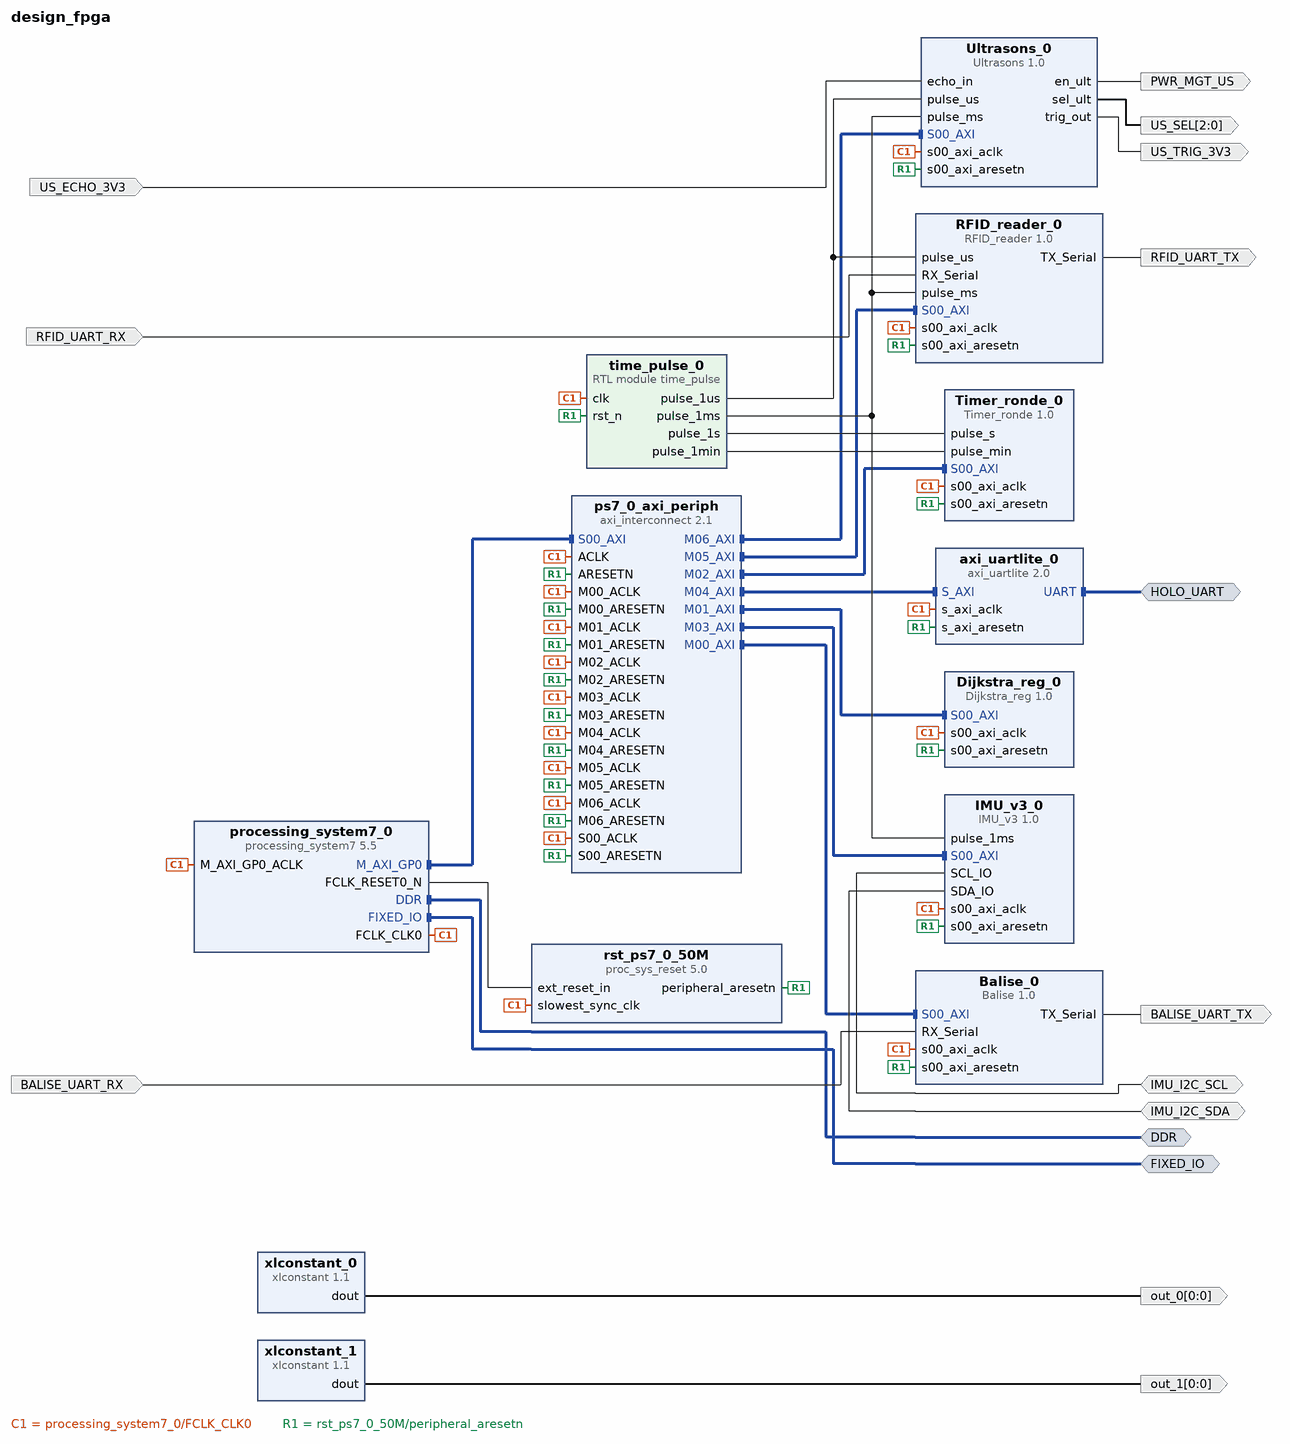
[diagram p0: block diagram of the top level]
# Vivado block design design_fpga, xc7z020clg400-1, Vivado 2020.2
create_bd_design design_fpga

create_bd_intf_port -mode Master -vlnv xilinx.com:interface:ddrx_rtl:1.0 DDR
create_bd_intf_port -mode Master -vlnv xilinx.com:display_processing_system7:fixedio_rtl:1.0 FIXED_IO
create_bd_intf_port -mode Master -vlnv xilinx.com:interface:uart_rtl:1.0 HOLO_UART
create_bd_port -dir I BALISE_UART_RX
create_bd_port -dir O BALISE_UART_TX
create_bd_port -dir IO IMU_I2C_SDA
create_bd_port -dir IO IMU_I2C_SCL
create_bd_port -dir I RFID_UART_RX
create_bd_port -dir O RFID_UART_TX
create_bd_port -dir I US_ECHO_3V3
create_bd_port -dir O PWR_MGT_US
create_bd_port -dir O -from 2 -to 0 US_SEL
create_bd_port -dir O US_TRIG_3V3
create_bd_port -dir O -from 0 -to 0 out_0
create_bd_port -dir O -from 0 -to 0 out_1

create_bd_cell -type module -reference time_pulse time_pulse_0
create_bd_cell -type ip -vlnv xilinx.com:ip:processing_system7:5.5 processing_system7_0
set_property -dict [list \
  CONFIG.PCW_APU_PERIPHERAL_FREQMHZ 667 \
  CONFIG.PCW_ENET0_ENET0_IO {MIO 16 .. 27} \
  CONFIG.PCW_ENET0_GRP_MDIO_ENABLE 1 \
  CONFIG.PCW_ENET0_GRP_MDIO_IO {MIO 52 .. 53} \
  CONFIG.PCW_ENET0_PERIPHERAL_ENABLE 1 \
  CONFIG.PCW_ENET0_RESET_ENABLE 0 \
  CONFIG.PCW_ENET_RESET_ENABLE 1 \
  CONFIG.PCW_ENET_RESET_SELECT {Share reset pin} \
  CONFIG.PCW_FPGA1_PERIPHERAL_FREQMHZ 155 \
  CONFIG.PCW_GPIO_MIO_GPIO_ENABLE 1 \
  CONFIG.PCW_GPIO_MIO_GPIO_IO MIO \
  CONFIG.PCW_I2C_RESET_ENABLE 1 \
  CONFIG.PCW_PRESET_BANK1_VOLTAGE {LVCMOS 1.8V} \
  CONFIG.PCW_QSPI_GRP_FBCLK_ENABLE 1 \
  CONFIG.PCW_QSPI_GRP_FBCLK_IO {MIO 8} \
  CONFIG.PCW_QSPI_GRP_SINGLE_SS_ENABLE 1 \
  CONFIG.PCW_QSPI_GRP_SINGLE_SS_IO {MIO 1 .. 6} \
  CONFIG.PCW_QSPI_PERIPHERAL_ENABLE 1 \
  CONFIG.PCW_QSPI_QSPI_IO {MIO 1 .. 6} \
  CONFIG.PCW_SD0_GRP_CD_ENABLE 1 \
  CONFIG.PCW_SD0_GRP_CD_IO {MIO 47} \
  CONFIG.PCW_SD0_GRP_WP_ENABLE 0 \
  CONFIG.PCW_SD0_PERIPHERAL_ENABLE 1 \
  CONFIG.PCW_SD0_SD0_IO {MIO 40 .. 45} \
  CONFIG.PCW_SDIO_PERIPHERAL_FREQMHZ 50 \
  CONFIG.PCW_SINGLE_QSPI_DATA_MODE x4 \
  CONFIG.PCW_UART1_PERIPHERAL_ENABLE 1 \
  CONFIG.PCW_UART1_UART1_IO {MIO 48 .. 49} \
  CONFIG.PCW_UART_PERIPHERAL_FREQMHZ 100 \
  CONFIG.PCW_UIPARAM_DDR_FREQ_MHZ 533.333333 \
  CONFIG.PCW_UIPARAM_DDR_MEMORY_TYPE {DDR 3 (Low Voltage)} \
  CONFIG.PCW_UIPARAM_DDR_PARTNO {MT41K256M16 RE-125} \
  CONFIG.PCW_USB0_PERIPHERAL_ENABLE 1 \
  CONFIG.PCW_USB0_RESET_ENABLE 1 \
  CONFIG.PCW_USB0_RESET_IO {MIO 46} \
  CONFIG.PCW_USB0_USB0_IO {MIO 28 .. 39} \
  CONFIG.PCW_USB_RESET_ENABLE 1 \
  CONFIG.PCW_USB_RESET_SELECT {Share reset pin} \
] [get_bd_cells processing_system7_0]
# 298 more settings of processing_system7_0 are not shown: defaults, MIO pin electricals, DDR timing, and values the tool derives
create_bd_cell -type ip -vlnv xilinx.com:ip:axi_interconnect:2.1 ps7_0_axi_periph
set_property -dict {CONFIG.NUM_MI 7 CONFIG.NUM_SI 1} [get_bd_cells ps7_0_axi_periph]
create_bd_cell -type ip -vlnv xilinx.com:ip:proc_sys_reset:5.0 rst_ps7_0_50M
create_bd_cell -type ip -vlnv xilinx.com:ip:axi_uartlite:2.0 axi_uartlite_0
set_property -dict {CONFIG.C_BAUDRATE 115200} [get_bd_cells axi_uartlite_0]
create_bd_cell -type ip -vlnv elsys-design.com:user:Balise:1.0 Balise_0
create_bd_cell -type ip -vlnv elsys-design.com:user:Dijkstra_reg:1.0 Dijkstra_reg_0
create_bd_cell -type ip -vlnv elsys-design.com:user:IMU_v3:1.0 IMU_v3_0
create_bd_cell -type ip -vlnv elsys-design.com:user:Timer_ronde:1.0 Timer_ronde_0
create_bd_cell -type ip -vlnv elsys-design.com:user:RFID_reader:1.0 RFID_reader_0
create_bd_cell -type ip -vlnv xilinx.com:ip:xlconstant:1.1 xlconstant_0
set_property -dict {CONFIG.CONST_VAL 0} [get_bd_cells xlconstant_0]
create_bd_cell -type ip -vlnv xilinx.com:ip:xlconstant:1.1 xlconstant_1
create_bd_cell -type ip -vlnv elsys-design.com:user:Ultrasons:1.0 Ultrasons_0

# ---- connections ----

connect_bd_intf_net [get_bd_intf_ports DDR] [get_bd_intf_pins processing_system7_0/DDR]
connect_bd_intf_net [get_bd_intf_pins ps7_0_axi_periph/M02_AXI] [get_bd_intf_pins Timer_ronde_0/S00_AXI]
connect_bd_intf_net [get_bd_intf_pins ps7_0_axi_periph/M05_AXI] [get_bd_intf_pins RFID_reader_0/S00_AXI]
connect_bd_intf_net [get_bd_intf_pins ps7_0_axi_periph/M03_AXI] [get_bd_intf_pins IMU_v3_0/S00_AXI]
connect_bd_intf_net [get_bd_intf_ports HOLO_UART] [get_bd_intf_pins axi_uartlite_0/UART]
connect_bd_intf_net [get_bd_intf_pins ps7_0_axi_periph/M00_AXI] [get_bd_intf_pins Balise_0/S00_AXI]
connect_bd_intf_net [get_bd_intf_pins processing_system7_0/M_AXI_GP0] [get_bd_intf_pins ps7_0_axi_periph/S00_AXI]
connect_bd_intf_net [get_bd_intf_pins ps7_0_axi_periph/M04_AXI] [get_bd_intf_pins axi_uartlite_0/S_AXI]
connect_bd_intf_net [get_bd_intf_pins ps7_0_axi_periph/M06_AXI] [get_bd_intf_pins Ultrasons_0/S00_AXI]
connect_bd_intf_net [get_bd_intf_ports FIXED_IO] [get_bd_intf_pins processing_system7_0/FIXED_IO]
connect_bd_intf_net [get_bd_intf_pins ps7_0_axi_periph/M01_AXI] [get_bd_intf_pins Dijkstra_reg_0/S00_AXI]
connect_bd_net [get_bd_pins processing_system7_0/FCLK_CLK0] \
  [get_bd_pins processing_system7_0/M_AXI_GP0_ACLK] [get_bd_pins ps7_0_axi_periph/S00_ACLK] \
  [get_bd_pins rst_ps7_0_50M/slowest_sync_clk] [get_bd_pins ps7_0_axi_periph/M00_ACLK] [get_bd_pins ps7_0_axi_periph/ACLK] \
  [get_bd_pins ps7_0_axi_periph/M01_ACLK] [get_bd_pins time_pulse_0/clk] [get_bd_pins ps7_0_axi_periph/M02_ACLK] \
  [get_bd_pins ps7_0_axi_periph/M03_ACLK] [get_bd_pins Balise_0/s00_axi_aclk] [get_bd_pins Dijkstra_reg_0/s00_axi_aclk] \
  [get_bd_pins axi_uartlite_0/s_axi_aclk] [get_bd_pins ps7_0_axi_periph/M04_ACLK] [get_bd_pins IMU_v3_0/s00_axi_aclk] \
  [get_bd_pins Timer_ronde_0/s00_axi_aclk] [get_bd_pins RFID_reader_0/s00_axi_aclk] [get_bd_pins ps7_0_axi_periph/M05_ACLK] \
  [get_bd_pins ps7_0_axi_periph/M06_ACLK] [get_bd_pins Ultrasons_0/s00_axi_aclk]
connect_bd_net [get_bd_pins processing_system7_0/FCLK_RESET0_N] [get_bd_pins rst_ps7_0_50M/ext_reset_in]
connect_bd_net [get_bd_pins rst_ps7_0_50M/peripheral_aresetn] \
  [get_bd_pins ps7_0_axi_periph/S00_ARESETN] [get_bd_pins ps7_0_axi_periph/M00_ARESETN] \
  [get_bd_pins ps7_0_axi_periph/ARESETN] [get_bd_pins ps7_0_axi_periph/M01_ARESETN] \
  [get_bd_pins ps7_0_axi_periph/M02_ARESETN] [get_bd_pins ps7_0_axi_periph/M03_ARESETN] [get_bd_pins time_pulse_0/rst_n] \
  [get_bd_pins Balise_0/s00_axi_aresetn] [get_bd_pins Dijkstra_reg_0/s00_axi_aresetn] \
  [get_bd_pins axi_uartlite_0/s_axi_aresetn] [get_bd_pins ps7_0_axi_periph/M04_ARESETN] \
  [get_bd_pins IMU_v3_0/s00_axi_aresetn] [get_bd_pins Timer_ronde_0/s00_axi_aresetn] \
  [get_bd_pins RFID_reader_0/s00_axi_aresetn] [get_bd_pins ps7_0_axi_periph/M05_ARESETN] \
  [get_bd_pins ps7_0_axi_periph/M06_ARESETN] [get_bd_pins Ultrasons_0/s00_axi_aresetn]
connect_bd_net -net RX_Serial_0_1 [get_bd_ports BALISE_UART_RX] [get_bd_pins Balise_0/RX_Serial]
connect_bd_net [get_bd_pins Balise_0/TX_Serial] [get_bd_ports BALISE_UART_TX]
connect_bd_net [get_bd_pins time_pulse_0/pulse_1s] [get_bd_pins Timer_ronde_0/pulse_s]
connect_bd_net [get_bd_pins time_pulse_0/pulse_1min] [get_bd_pins Timer_ronde_0/pulse_min]
connect_bd_net [get_bd_ports IMU_I2C_SDA] [get_bd_pins IMU_v3_0/SDA_IO]
connect_bd_net [get_bd_ports IMU_I2C_SCL] [get_bd_pins IMU_v3_0/SCL_IO]
connect_bd_net [get_bd_pins time_pulse_0/pulse_1ms] \
  [get_bd_pins IMU_v3_0/pulse_1ms] [get_bd_pins RFID_reader_0/pulse_ms] [get_bd_pins Ultrasons_0/pulse_ms]
connect_bd_net [get_bd_pins time_pulse_0/pulse_1us] [get_bd_pins RFID_reader_0/pulse_us] [get_bd_pins Ultrasons_0/pulse_us]
connect_bd_net -net RX_Serial_0_2 [get_bd_ports RFID_UART_RX] [get_bd_pins RFID_reader_0/RX_Serial]
connect_bd_net [get_bd_pins RFID_reader_0/TX_Serial] [get_bd_ports RFID_UART_TX]
connect_bd_net -net echo_in_0_1 [get_bd_ports US_ECHO_3V3] [get_bd_pins Ultrasons_0/echo_in]
connect_bd_net [get_bd_pins Ultrasons_0/en_ult] [get_bd_ports PWR_MGT_US]
connect_bd_net [get_bd_pins Ultrasons_0/sel_ult] [get_bd_ports US_SEL]
connect_bd_net [get_bd_pins Ultrasons_0/trig_out] [get_bd_ports US_TRIG_3V3]
connect_bd_net [get_bd_pins xlconstant_0/dout] [get_bd_ports out_0]
connect_bd_net [get_bd_pins xlconstant_1/dout] [get_bd_ports out_1]

# ---- address map ----
assign_bd_address -offset 0x42C00000 -range 64K -target_address_space [get_bd_addr_spaces processing_system7_0/Data] [get_bd_addr_segs axi_uartlite_0/S_AXI/Reg]
assign_bd_address -offset 0x43C00000 -range 64K -target_address_space [get_bd_addr_spaces processing_system7_0/Data] [get_bd_addr_segs Balise_0/S00_AXI/S00_AXI_reg]
assign_bd_address -offset 0x43C10000 -range 64K -target_address_space [get_bd_addr_spaces processing_system7_0/Data] [get_bd_addr_segs Dijkstra_reg_0/S00_AXI/S00_AXI_reg]
assign_bd_address -offset 0x43C20000 -range 64K -target_address_space [get_bd_addr_spaces processing_system7_0/Data] [get_bd_addr_segs IMU_v3_0/S00_AXI/S00_AXI_reg]
assign_bd_address -offset 0x43C30000 -range 64K -target_address_space [get_bd_addr_spaces processing_system7_0/Data] [get_bd_addr_segs Timer_ronde_0/S00_AXI/S00_AXI_reg]
assign_bd_address -offset 0x43C40000 -range 64K -target_address_space [get_bd_addr_spaces processing_system7_0/Data] [get_bd_addr_segs RFID_reader_0/S00_AXI/S00_AXI_reg]
assign_bd_address -offset 0x43C50000 -range 64K -target_address_space [get_bd_addr_spaces processing_system7_0/Data] [get_bd_addr_segs Ultrasons_0/S00_AXI/S00_AXI_reg]

validate_bd_design
save_bd_design
